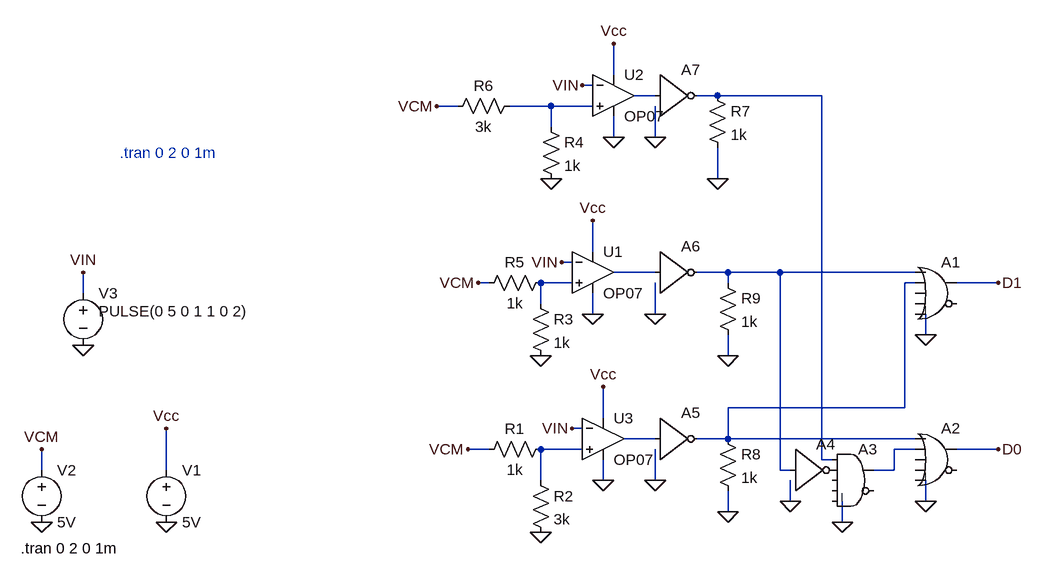
[diagram p0: schematic two_bit_ADC.asc]
two_bit_ADC.asc, the LTspice schematic file:
Version 4.1
SHEET 1 1000 680
WIRE 224 -464 224 -512
WIRE 192 -448 176 -448
WIRE 288 -432 256 -432
WIRE 384 -432 352 -432
WIRE 544 -432 384 -432
WIRE -16 -416 -48 -416
WIRE 128 -416 64 -416
WIRE 192 -416 128 -416
WIRE 128 -384 128 -416
WIRE 224 -368 224 -400
WIRE 288 -368 288 -416
WIRE 384 -304 384 -352
WIRE 192 -192 192 -240
WIRE 160 -176 144 -176
WIRE 288 -160 224 -160
WIRE 400 -160 352 -160
WIRE 480 -160 400 -160
WIRE 688 -160 480 -160
WIRE 32 -144 16 -144
WIRE 160 -144 112 -144
WIRE 400 -144 400 -160
WIRE 688 -144 672 -144
WIRE 816 -144 752 -144
WIRE -592 -128 -592 -160
WIRE 112 -112 112 -144
WIRE 192 -96 192 -128
WIRE 288 -96 288 -144
WIRE 704 -64 704 -96
WIRE 400 -32 400 -64
WIRE 672 48 672 -144
WIRE 672 48 400 48
WIRE 208 64 208 16
WIRE 176 80 160 80
WIRE 288 96 240 96
WIRE 400 96 400 48
WIRE 400 96 352 96
WIRE 688 96 400 96
WIRE 32 112 0 112
WIRE 176 112 112 112
WIRE 688 112 656 112
WIRE 816 112 752 112
WIRE 544 128 544 -432
WIRE 560 128 544 128
WIRE -656 144 -656 112
WIRE -464 144 -464 80
WIRE 480 144 480 -160
WIRE 496 144 480 144
WIRE 656 144 656 112
WIRE 656 144 624 144
WIRE 112 160 112 112
WIRE 208 160 208 128
WIRE 288 160 288 112
WIRE 496 192 496 160
WIRE 704 192 704 160
WIRE 400 208 400 176
WIRE 576 224 576 192
FLAG 208 160 0
FLAG 192 -96 0
FLAG 224 -368 0
FLAG -656 112 VCM
FLAG 0 112 VCM
FLAG 16 -144 VCM
FLAG -48 -416 VCM
FLAG -464 80 Vcc
FLAG 208 16 Vcc
FLAG 192 -240 Vcc
FLAG 224 -512 Vcc
FLAG -592 -160 VIN
FLAG 160 80 VIN
FLAG 144 -176 VIN
FLAG 176 -448 VIN
FLAG 112 240 0
FLAG 112 -32 0
FLAG 128 -304 0
FLAG 384 -304 0
FLAG 400 -32 0
FLAG 400 208 0
FLAG -464 224 0
FLAG -656 224 0
FLAG -592 -48 0
FLAG 704 -64 0
FLAG 704 192 0
FLAG 576 224 0
FLAG 496 192 0
FLAG 816 112 D0
FLAG 816 -144 D1
FLAG 288 -368 0
FLAG 288 -96 0
FLAG 288 160 0
SYMBOL OpAmps\\OP07 192 -224 R0
SYMATTR InstName U1
SYMBOL OpAmps\\OP07 224 -496 R0
SYMATTR InstName U2
SYMBOL OpAmps\\OP07 208 32 R0
SYMATTR InstName U3
SYMBOL voltage -464 128 R0
WINDOW 123 0 0 Left 0
WINDOW 39 0 0 Left 0
SYMATTR InstName V1
SYMATTR Value 5V
SYMBOL voltage -656 128 R0
WINDOW 123 0 0 Left 0
WINDOW 39 0 0 Left 0
SYMATTR InstName V2
SYMATTR Value 5V
SYMBOL res 128 96 R90
WINDOW 0 0 56 VBottom 2
WINDOW 3 32 56 VTop 2
SYMATTR InstName R1
SYMATTR Value 1k
SYMBOL res 96 144 R0
SYMATTR InstName R2
SYMATTR Value 3k
SYMBOL res 96 -128 R0
SYMATTR InstName R3
SYMATTR Value 1k
SYMBOL res 112 -400 R0
SYMATTR InstName R4
SYMATTR Value 1k
SYMBOL voltage -592 -144 R0
WINDOW 3 24 44 Left 2
WINDOW 123 0 0 Left 0
WINDOW 39 0 0 Left 0
SYMATTR Value PULSE(0 5 0 1 1 0 2)
SYMATTR InstName V3
SYMBOL res 128 -160 R90
WINDOW 0 0 56 VBottom 2
WINDOW 3 32 56 VTop 2
SYMATTR InstName R5
SYMATTR Value 1k
SYMBOL res 80 -432 R90
WINDOW 0 0 56 VBottom 2
WINDOW 3 32 56 VTop 2
SYMATTR InstName R6
SYMATTR Value 3k
SYMBOL res 368 -448 R0
SYMATTR InstName R7
SYMATTR Value 1k
SYMBOL res 384 80 R0
SYMATTR InstName R8
SYMATTR Value 1k
SYMBOL res 384 -160 R0
SYMATTR InstName R9
SYMATTR Value 1k
SYMBOL Digital\\or 720 -192 R0
WINDOW 3 -8 36 Invisible 2
SYMATTR Value Vhigh=5 Vlow=0 Vt=2.5
SYMATTR InstName A1
SYMBOL Digital\\or 720 64 R0
WINDOW 3 -8 36 Invisible 2
SYMATTR Value Vhigh=5 Vlow=0 Vt=2.5
SYMATTR InstName A2
SYMBOL Digital\\and 592 96 R0
WINDOW 3 16 52 Invisible 2
SYMATTR Value Vhigh=5 Vlow=0 Vt=2.5
SYMATTR InstName A3
SYMBOL Digital\\inv 496 80 R0
WINDOW 3 8 60 Invisible 2
SYMATTR Value Vhigh=5 Vlow=0 Vt=2.5
SYMATTR InstName A4
SYMBOL Digital\\inv 288 32 R0
WINDOW 3 8 60 Invisible 2
SYMATTR Value Vhigh=5 Vlow=0 Vt=2.5
SYMATTR InstName A5
SYMBOL Digital\\inv 288 -224 R0
WINDOW 3 8 60 Invisible 2
SYMATTR Value Vhigh=5 Vlow=0 Vt=2.5
SYMATTR InstName A6
SYMBOL Digital\\inv 288 -496 R0
WINDOW 3 8 60 Invisible 2
SYMATTR Value Vhigh=5 Vlow=0 Vt=2.5
SYMATTR InstName A7
TEXT -688 264 Left 2 !.tran 0 2 0 1m
TEXT -536 -344 Left 2 ;.tran 0 2 0 1m

The netlist it stands for:
* two_bit_ADC.asc
X§U1 N006 VIN Vcc 0 N004 LT1001  ; OP07, pins In+ In- V+ V- OUT
X§U2 N003 VIN Vcc 0 N001 LT1001  ; OP07, pins In+ In- V+ V- OUT
X§U3 N009 VIN Vcc 0 N008 LT1001  ; OP07, pins In+ In- V+ V- OUT
V1 Vcc 0 5V
V2 VCM 0 5V
R1 N009 VCM 1k
R2 N009 0 3k
R3 N006 0 1k
R4 N003 0 1k
V3 VIN 0 PULSE(0 5 0 1 1 0 2)
R5 N006 VCM 1k
R6 N003 VCM 3k
R7 N002 0 1k
R8 N007 0 1k
R9 N005 0 1k
A1 N005 N007 0 0 0 0 D1 0 OR Vhigh=5 Vlow=0 Vt=2.5
A2 N007 N010 0 0 0 0 D0 0 OR Vhigh=5 Vlow=0 Vt=2.5
A3 N002 P001 0 0 0 0 N010 0 AND Vhigh=5 Vlow=0 Vt=2.5
A4 N005 0 0 0 0 P001 0 0 BUF Vhigh=5 Vlow=0 Vt=2.5
A5 N008 0 0 0 0 N007 0 0 BUF Vhigh=5 Vlow=0 Vt=2.5
A6 N004 0 0 0 0 N005 0 0 BUF Vhigh=5 Vlow=0 Vt=2.5
A7 N001 0 0 0 0 N002 0 0 BUF Vhigh=5 Vlow=0 Vt=2.5
.tran 0 2 0 1m
* .tran 0 2 0 1m
.lib LTC.lib
.backanno
.end